# Altium schematic sheet ColormusicOpamp.SchDoc
size A3; SheetNumber: 1; SheetTotal: 2
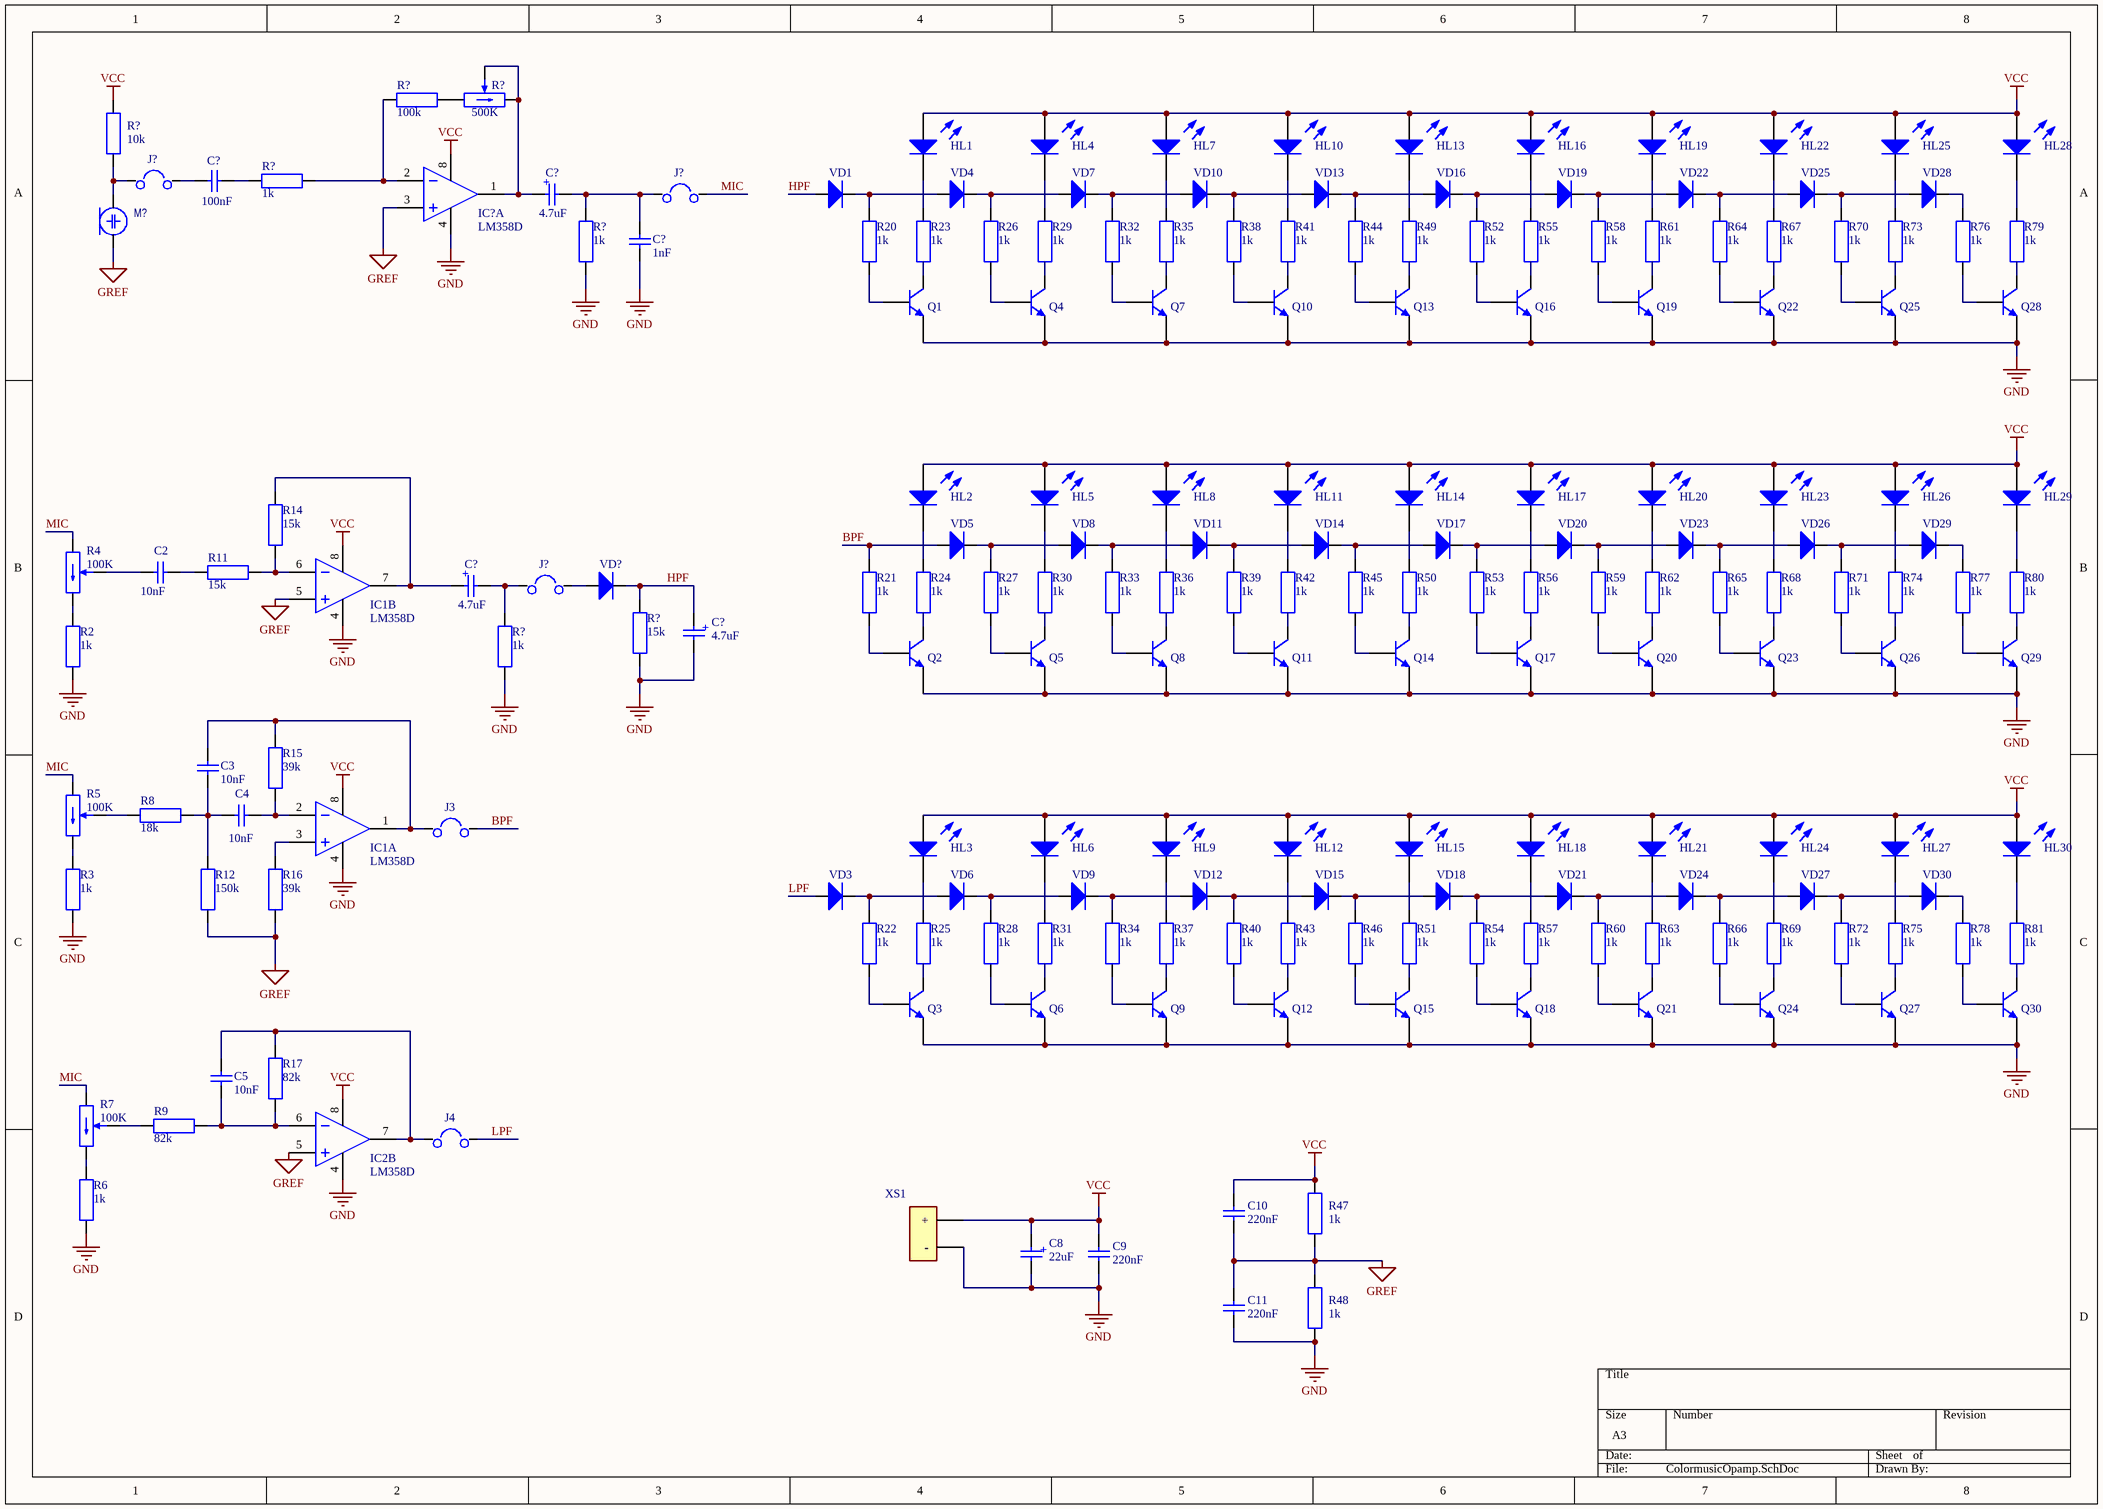
[diagram p0: ColormusicOpamp.SchDoc]

## Parts
(Parts that share a designator on the sheet are numbered #1, #2 ... from top to bottom, then left to right.)
C2  10nF  [CAP-CER-DISK]
C3  10nF  [CAP-CER-DISK]
C4  10nF  [CAP-CER-DISK]
C5  10nF  [CAP-CER-DISK]
C8  22uF  [CAP-ELEC-5x11mm]
C9  220nF  [CAP-CER-DISK]
C10  220nF  [CAP-CER-DISK]
C11  220nF  [CAP-CER-DISK]
C?#1  100nF  [CAP-CER-DISK]
C?#2  4.7uF  [CAP-ELEC-5x11mm]
C?#3  1nF  [CAP-CER-DISK]
C?#4  4.7uF  [CAP-ELEC-5x11mm]
C?#5  4.7uF  [CAP-ELEC-5x11mm]
HL1  LED_Mirrored  [LED_RED_5MM]  (value not drawn)
HL2  LED_Mirrored  [LED_RED_5MM]  (value not drawn)
HL3  LED_Mirrored  [LED_RED_5MM]  (value not drawn)
HL4  LED_Mirrored  [LED_RED_5MM]  (value not drawn)
HL5  LED_Mirrored  [LED_RED_5MM]  (value not drawn)
HL6  LED_Mirrored  [LED_RED_5MM]  (value not drawn)
HL7  LED_Mirrored  [LED_RED_5MM]  (value not drawn)
HL8  LED_Mirrored  [LED_RED_5MM]  (value not drawn)
HL9  LED_Mirrored  [LED_RED_5MM]  (value not drawn)
HL10  LED_Mirrored  [LED_RED_5MM]  (value not drawn)
HL11  LED_Mirrored  [LED_RED_5MM]  (value not drawn)
HL12  LED_Mirrored  [LED_RED_5MM]  (value not drawn)
HL13  LED_Mirrored  [LED_RED_5MM]  (value not drawn)
HL14  LED_Mirrored  [LED_RED_5MM]  (value not drawn)
HL15  LED_Mirrored  [LED_RED_5MM]  (value not drawn)
HL16  LED_Mirrored  [LED_RED_5MM]  (value not drawn)
HL17  LED_Mirrored  [LED_RED_5MM]  (value not drawn)
HL18  LED_Mirrored  [LED_RED_5MM]  (value not drawn)
HL19  LED_Mirrored  [LED_RED_5MM]  (value not drawn)
HL20  LED_Mirrored  [LED_RED_5MM]  (value not drawn)
HL21  LED_Mirrored  [LED_RED_5MM]  (value not drawn)
HL22  LED_Mirrored  [LED_RED_5MM]  (value not drawn)
HL23  LED_Mirrored  [LED_RED_5MM]  (value not drawn)
HL24  LED_Mirrored  [LED_RED_5MM]  (value not drawn)
HL25  LED_Mirrored  [LED_RED_5MM]  (value not drawn)
HL26  LED_Mirrored  [LED_RED_5MM]  (value not drawn)
HL27  LED_Mirrored  [LED_RED_5MM]  (value not drawn)
HL28  LED_Mirrored  [LED_RED_5MM]  (value not drawn)
HL29  LED_Mirrored  [LED_RED_5MM]  (value not drawn)
HL30  LED_Mirrored  [LED_RED_5MM]  (value not drawn)
IC1  LM358D  [DIP-8]  (parts A,B of 2)
IC2  LM358D  [DIP-8]  (part B of 2)
IC?  LM358D  [DIP-8]  (part A of 2)
J3  Jumper0805  [Jumper]  (value not drawn)
J4  Jumper0805  [Jumper]  (value not drawn)
J?#1  Jumper0805  [Jumper]  (value not drawn)
J?#2  Jumper0805  [Jumper]  (value not drawn)
J?#3  Jumper0805  [Jumper]  (value not drawn)
M?  Microphine_Cap  [Jumper]  (value not drawn)
Q1  NPN  (value not drawn)
Q2  NPN  (value not drawn)
Q3  NPN  (value not drawn)
Q4  NPN  (value not drawn)
Q5  NPN  (value not drawn)
Q6  NPN  (value not drawn)
Q7  NPN  (value not drawn)
Q8  NPN  (value not drawn)
Q9  NPN  (value not drawn)
Q10  NPN  (value not drawn)
Q11  NPN  (value not drawn)
Q12  NPN  (value not drawn)
Q13  NPN  (value not drawn)
Q14  NPN  (value not drawn)
Q15  NPN  (value not drawn)
Q16  NPN  (value not drawn)
Q17  NPN  (value not drawn)
Q18  NPN  (value not drawn)
Q19  NPN  (value not drawn)
Q20  NPN  (value not drawn)
Q21  NPN  (value not drawn)
Q22  NPN  (value not drawn)
Q23  NPN  (value not drawn)
Q24  NPN  (value not drawn)
Q25  NPN  (value not drawn)
Q26  NPN  (value not drawn)
Q27  NPN  (value not drawn)
Q28  NPN  (value not drawn)
Q29  NPN  (value not drawn)
Q30  NPN  (value not drawn)
R2  1k  [Res-Axis]
R3  1k  [Res-Axis]
R4  100K  [res-pot]
R5  100K  [res-pot]
R6  1k  [Res-Axis]
R7  100K  [res-pot]
R8  18k  [Res-Axis]
R9  82k  [Res-Axis]
R11  15k  [Res-Axis]
R12  150k  [Res-Axis]
R14  15k  [Res-Axis]
R15  39k  [Res-Axis]
R16  39k  [Res-Axis]
R17  82k  [Res-Axis]
R20  1k  [Res-Axis]
R21  1k  [Res-Axis]
R22  1k  [Res-Axis]
R23  1k  [Res-Axis]
R24  1k  [Res-Axis]
R25  1k  [Res-Axis]
R26  1k  [Res-Axis]
R27  1k  [Res-Axis]
R28  1k  [Res-Axis]
R29  1k  [Res-Axis]
R30  1k  [Res-Axis]
R31  1k  [Res-Axis]
R32  1k  [Res-Axis]
R33  1k  [Res-Axis]
R34  1k  [Res-Axis]
R35  1k  [Res-Axis]
R36  1k  [Res-Axis]
R37  1k  [Res-Axis]
R38  1k  [Res-Axis]
R39  1k  [Res-Axis]
R40  1k  [Res-Axis]
R41  1k  [Res-Axis]
R42  1k  [Res-Axis]
R43  1k  [Res-Axis]
R44  1k  [Res-Axis]
R45  1k  [Res-Axis]
R46  1k  [Res-Axis]
R47  1k  [Res-Axis]
R48  1k  [Res-Axis]
R49  1k  [Res-Axis]
R50  1k  [Res-Axis]
R51  1k  [Res-Axis]
R52  1k  [Res-Axis]
R53  1k  [Res-Axis]
R54  1k  [Res-Axis]
R55  1k  [Res-Axis]
R56  1k  [Res-Axis]
R57  1k  [Res-Axis]
R58  1k  [Res-Axis]
R59  1k  [Res-Axis]
R60  1k  [Res-Axis]
R61  1k  [Res-Axis]
R62  1k  [Res-Axis]
R63  1k  [Res-Axis]
R64  1k  [Res-Axis]
R65  1k  [Res-Axis]
R66  1k  [Res-Axis]
R67  1k  [Res-Axis]
R68  1k  [Res-Axis]
R69  1k  [Res-Axis]
R70  1k  [Res-Axis]
R71  1k  [Res-Axis]
R72  1k  [Res-Axis]
R73  1k  [Res-Axis]
R74  1k  [Res-Axis]
R75  1k  [Res-Axis]
R76  1k  [Res-Axis]
R77  1k  [Res-Axis]
R78  1k  [Res-Axis]
R79  1k  [Res-Axis]
R80  1k  [Res-Axis]
R81  1k  [Res-Axis]
R?#1  500K  [res-pot]
R?#2  100k  [Res-Axis]
R?#3  10k  [Res-Axis]
R?#4  1k  [Res-Axis]
R?#5  1k  [Res-Axis]
R?#6  1k  [Res-Axis]
R?#7  15k  [Res-Axis]
VD1  Diode  [DIODE-AXIS]  (value not drawn)
VD3  Diode  [DIODE-AXIS]  (value not drawn)
VD4  Diode  [DIODE-AXIS]  (value not drawn)
VD5  Diode  [DIODE-AXIS]  (value not drawn)
VD6  Diode  [DIODE-AXIS]  (value not drawn)
VD7  Diode  [DIODE-AXIS]  (value not drawn)
VD8  Diode  [DIODE-AXIS]  (value not drawn)
VD9  Diode  [DIODE-AXIS]  (value not drawn)
VD10  Diode  [DIODE-AXIS]  (value not drawn)
VD11  Diode  [DIODE-AXIS]  (value not drawn)
VD12  Diode  [DIODE-AXIS]  (value not drawn)
VD13  Diode  [DIODE-AXIS]  (value not drawn)
VD14  Diode  [DIODE-AXIS]  (value not drawn)
VD15  Diode  [DIODE-AXIS]  (value not drawn)
VD16  Diode  [DIODE-AXIS]  (value not drawn)
VD17  Diode  [DIODE-AXIS]  (value not drawn)
VD18  Diode  [DIODE-AXIS]  (value not drawn)
VD19  Diode  [DIODE-AXIS]  (value not drawn)
VD20  Diode  [DIODE-AXIS]  (value not drawn)
VD21  Diode  [DIODE-AXIS]  (value not drawn)
VD22  Diode  [DIODE-AXIS]  (value not drawn)
VD23  Diode  [DIODE-AXIS]  (value not drawn)
VD24  Diode  [DIODE-AXIS]  (value not drawn)
VD25  Diode  [DIODE-AXIS]  (value not drawn)
VD26  Diode  [DIODE-AXIS]  (value not drawn)
VD27  Diode  [DIODE-AXIS]  (value not drawn)
VD28  Diode  [DIODE-AXIS]  (value not drawn)
VD29  Diode  [DIODE-AXIS]  (value not drawn)
VD30  Diode  [DIODE-AXIS]  (value not drawn)
VD?  Diode  [DIODE-MELF]  (value not drawn)
XS1  +5V  [USB-Micro]  (value not drawn)

## Nets
GND: C8.C C9.1 C11.1 C?#3.1 C?#5.C IC1.4(GND) IC2.4(GND) IC?.4(GND) Q1.E Q2.E Q3.E Q4.E Q5.E Q6.E Q7.E Q8.E Q9.E Q10.E Q11.E Q12.E Q13.E Q14.E Q15.E Q16.E Q17.E Q18.E Q19.E Q20.E Q21.E Q22.E Q23.E Q24.E Q25.E Q26.E Q27.E Q28.E Q29.E Q30.E R2.2 R3.2 R6.2 R48.1 R?#5.2 R?#6.2 R?#7.1 XS1.G(-)
GREF: C10.1 C11.2 IC1.5(INB+) IC2.5(INB+) IC?.3(INA+) M?.1 R12.1 R16.1 R47.1 R48.2
VCC: C8.A C9.2 C10.2 HL1.2(A) HL2.2(A) HL3.2(A) HL4.2(A) HL5.2(A) HL6.2(A) HL7.2(A) HL8.2(A) HL9.2(A) HL10.2(A) HL11.2(A) HL12.2(A) HL13.2(A) HL14.2(A) HL15.2(A) HL16.2(A) HL17.2(A) HL18.2(A) HL19.2(A) HL20.2(A) HL21.2(A) HL22.2(A) HL23.2(A) HL24.2(A) HL25.2(A) HL26.2(A) HL27.2(A) HL28.2(A) HL29.2(A) HL30.2(A) IC1.8(V+) IC2.8(V+) IC?.8(V+) R47.2 R?#3.2 XS1.V(+)
BPF: J3.2 R21.2 VD5.A
HPF: C?#5.A R?#7.2 VD1.A VD?.C
LPF: J4.2 VD3.A
MIC: J?#2.2 R4.1(CCW) R5.1(CCW) R7.1(CCW)
NetC2_1: C2.1 R4.3(W)
NetC2_2: C2.2 R11.1
NetC3_1: C3.1 C4.1 R8.2 R12.2
NetC3_2: C3.2 IC1.1(OUTA) J3.1 R15.2
NetC4_2: C4.2 IC1.2(INA-) R15.1
NetC5_1: C5.1 IC2.6(INB-) R9.2 R17.1
NetC5_2: C5.2 IC2.7(OUTB) J4.1 R17.2
NetC?#1_1: C?#1.1 R?#4.2
NetC?#1_2: C?#1.2 J?#1.2
NetC?#2_A: C?#2.A IC?.1(OUTA) R?#1.2(CW) R?#1.3(W)
NetC?#2_C: C?#2.C C?#3.2 J?#2.1 R?#5.1
NetC?#4_A: C?#4.A IC1.7(OUTB) R14.2
NetC?#4_C: C?#4.C J?#3.1 R?#6.1
NetHL1_1: HL1.1(C) R23.2
NetHL2_1: HL2.1(C) R24.2
NetHL3_1: HL3.1(C) R25.2
NetHL4_1: HL4.1(C) R29.2
NetHL5_1: HL5.1(C) R30.2
NetHL6_1: HL6.1(C) R31.2
NetHL7_1: HL7.1(C) R35.2
NetHL8_1: HL8.1(C) R36.2
NetHL9_1: HL9.1(C) R37.2
NetHL10_1: HL10.1(C) R41.2
NetHL11_1: HL11.1(C) R42.2
NetHL12_1: HL12.1(C) R43.2
NetHL13_1: HL13.1(C) R49.2
NetHL14_1: HL14.1(C) R50.2
NetHL15_1: HL15.1(C) R51.2
NetHL16_1: HL16.1(C) R55.2
NetHL17_1: HL17.1(C) R56.2
NetHL18_1: HL18.1(C) R57.2
NetHL19_1: HL19.1(C) R61.2
NetHL20_1: HL20.1(C) R62.2
NetHL21_1: HL21.1(C) R63.2
NetHL22_1: HL22.1(C) R67.2
NetHL23_1: HL23.1(C) R68.2
NetHL24_1: HL24.1(C) R69.2
NetHL25_1: HL25.1(C) R73.2
NetHL26_1: HL26.1(C) R74.2
NetHL27_1: HL27.1(C) R75.2
NetHL28_1: HL28.1(C) R79.2
NetHL29_1: HL29.1(C) R80.2
NetHL30_1: HL30.1(C) R81.2
NetIC1_3: IC1.3(INA+) R16.2
NetIC1_6: IC1.6(INB-) R11.2 R14.1
NetIC?_2: IC?.2(INA-) R?#2.2 R?#4.1
NetJ?#1_1: J?#1.1 M?.0 R?#3.1
NetJ?#3_2: J?#3.2 VD?.A
NetQ1_B: Q1.B R20.1
NetQ1_C: Q1.C R23.1
NetQ2_B: Q2.B R21.1
NetQ2_C: Q2.C R24.1
NetQ3_B: Q3.B R22.1
NetQ3_C: Q3.C R25.1
NetQ4_B: Q4.B R26.1
NetQ4_C: Q4.C R29.1
NetQ5_B: Q5.B R27.1
NetQ5_C: Q5.C R30.1
NetQ6_B: Q6.B R28.1
NetQ6_C: Q6.C R31.1
NetQ7_B: Q7.B R32.1
NetQ7_C: Q7.C R35.1
NetQ8_B: Q8.B R33.1
NetQ8_C: Q8.C R36.1
NetQ9_B: Q9.B R34.1
NetQ9_C: Q9.C R37.1
NetQ10_B: Q10.B R38.1
NetQ10_C: Q10.C R41.1
NetQ11_B: Q11.B R39.1
NetQ11_C: Q11.C R42.1
NetQ12_B: Q12.B R40.1
NetQ12_C: Q12.C R43.1
NetQ13_B: Q13.B R44.1
NetQ13_C: Q13.C R49.1
NetQ14_B: Q14.B R45.1
NetQ14_C: Q14.C R50.1
NetQ15_B: Q15.B R46.1
NetQ15_C: Q15.C R51.1
NetQ16_B: Q16.B R52.1
NetQ16_C: Q16.C R55.1
NetQ17_B: Q17.B R53.1
NetQ17_C: Q17.C R56.1
NetQ18_B: Q18.B R54.1
NetQ18_C: Q18.C R57.1
NetQ19_B: Q19.B R58.1
NetQ19_C: Q19.C R61.1
NetQ20_B: Q20.B R59.1
NetQ20_C: Q20.C R62.1
NetQ21_B: Q21.B R60.1
NetQ21_C: Q21.C R63.1
NetQ22_B: Q22.B R64.1
NetQ22_C: Q22.C R67.1
NetQ23_B: Q23.B R65.1
NetQ23_C: Q23.C R68.1
NetQ24_B: Q24.B R66.1
NetQ24_C: Q24.C R69.1
NetQ25_B: Q25.B R70.1
NetQ25_C: Q25.C R73.1
NetQ26_B: Q26.B R71.1
NetQ26_C: Q26.C R74.1
NetQ27_B: Q27.B R72.1
NetQ27_C: Q27.C R75.1
NetQ28_B: Q28.B R76.1
NetQ28_C: Q28.C R79.1
NetQ29_B: Q29.B R77.1
NetQ29_C: Q29.C R80.1
NetQ30_B: Q30.B R78.1
NetQ30_C: Q30.C R81.1
NetR2_1: R2.1 R4.2(CW)
NetR3_1: R3.1 R5.2(CW)
NetR5_3: R5.3(W) R8.1
NetR6_1: R6.1 R7.2(CW)
NetR7_3: R7.3(W) R9.1
NetR20_2: R20.2 VD1.C VD4.A
NetR22_2: R22.2 VD3.C VD6.A
NetR26_2: R26.2 VD4.C VD7.A
NetR27_2: R27.2 VD5.C VD8.A
NetR28_2: R28.2 VD6.C VD9.A
NetR32_2: R32.2 VD7.C VD10.A
NetR33_2: R33.2 VD8.C VD11.A
NetR34_2: R34.2 VD9.C VD12.A
NetR38_2: R38.2 VD10.C VD13.A
NetR39_2: R39.2 VD11.C VD14.A
NetR40_2: R40.2 VD12.C VD15.A
NetR44_2: R44.2 VD13.C VD16.A
NetR45_2: R45.2 VD14.C VD17.A
NetR46_2: R46.2 VD15.C VD18.A
NetR52_2: R52.2 VD16.C VD19.A
NetR53_2: R53.2 VD17.C VD20.A
NetR54_2: R54.2 VD18.C VD21.A
NetR58_2: R58.2 VD19.C VD22.A
NetR59_2: R59.2 VD20.C VD23.A
NetR60_2: R60.2 VD21.C VD24.A
NetR64_2: R64.2 VD22.C VD25.A
NetR65_2: R65.2 VD23.C VD26.A
NetR66_2: R66.2 VD24.C VD27.A
NetR70_2: R70.2 VD25.C VD28.A
NetR71_2: R71.2 VD26.C VD29.A
NetR72_2: R72.2 VD27.C VD30.A
NetR76_2: R76.2 VD28.C
NetR77_2: R77.2 VD29.C
NetR78_2: R78.2 VD30.C
NetR?#1_1: R?#1.1(CCW) R?#2.1

## Notes on the sheet
- (in symbol Cap_Polar) +

## Library data of the parts
C2-C5 C9-C11 C?#1 C?#3 = Cap
C8 C?#2 C?#4 C?#5 = Cap_Polar
IC1 IC2 IC? = LM358_Mirrored: LM358; Manufacturer: Texas Instruments; Код: 10; Part Number: LM358D; Temperature: 0 C / + 70 C; Creation Date: 12.06.2019; Author: Maxim Tarasov
J3 J4 J?#1-J?#3 = Jumper
R2 R3 R6 R20-R81 R?#4-R?#6 = Res: Value: 1k
R4 R5 R7 R?#1 = Res_Pot
R8 R9 R11 R12 R14-R17 R?#2 R?#3 R?#7 = Res: Value: 1k
XS1 = Power Socket: Part Number: 1981584-1; Manufacturer: TE Connectivity / AMP; Код: 14; VALUE: 5V; Temperature: 0 C / + 50 C; Creation Date: 19.06.2019; Author: Tarasov Maxim